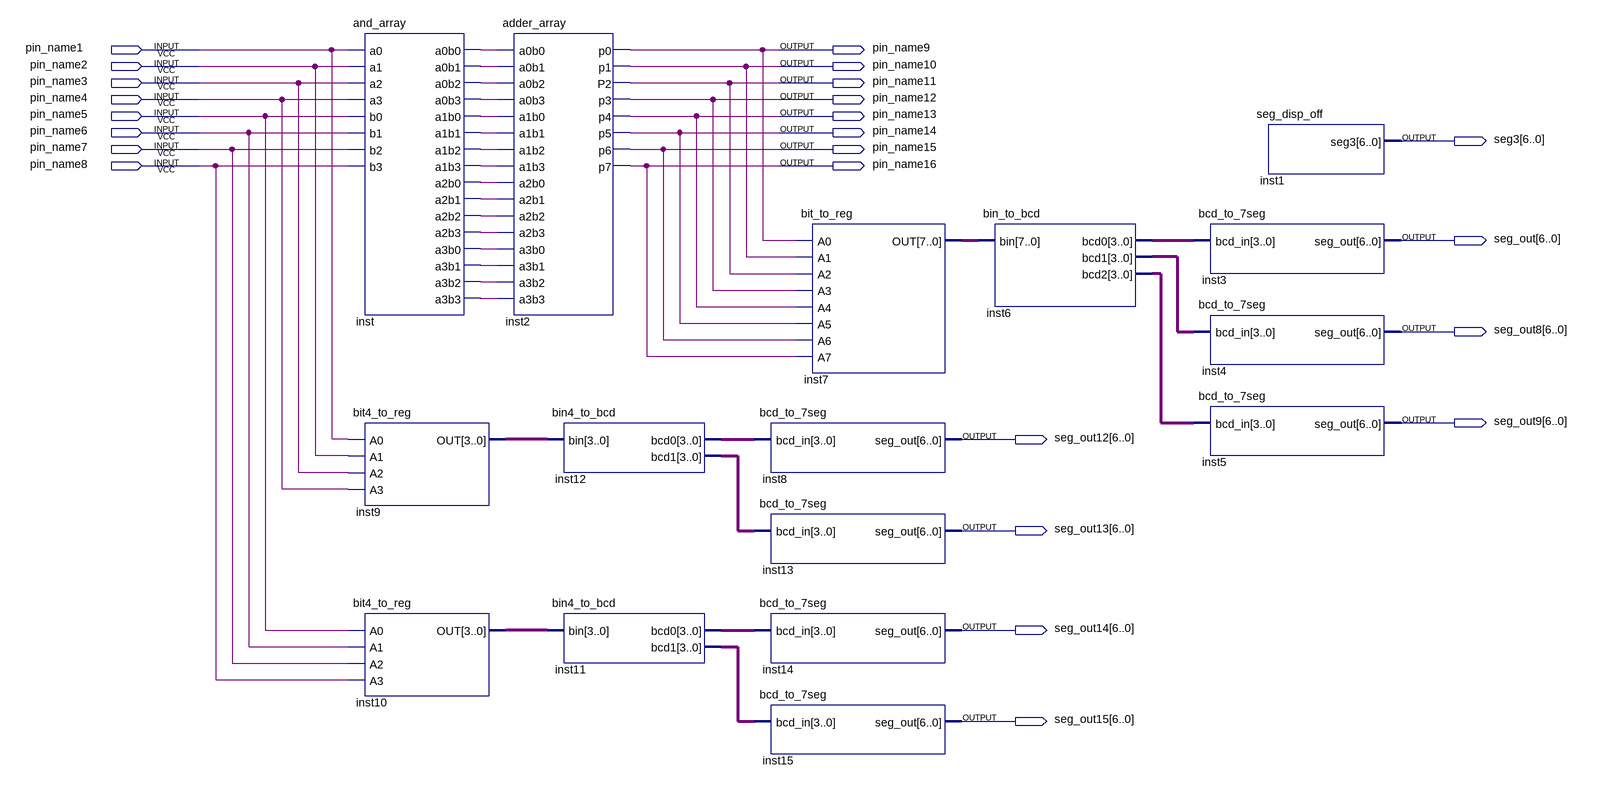
[diagram p0: schematic sheet]
// Quartus schematic multiplier_v.bdf as structural Verilog: 16 symbols, 24 pins
module multiplier_v (
  input  pin_name1,
  input  pin_name2,
  input  pin_name3,
  input  pin_name4,
  input  pin_name5,
  input  pin_name6,
  input  pin_name7,
  input  pin_name8,
  output pin_name9,
  output pin_name10,
  output pin_name11,
  output pin_name12,
  output pin_name13,
  output pin_name14,
  output [6:0] seg3,
  output pin_name15,
  output pin_name16,
  output [6:0] seg_out,
  output [6:0] seg_out8,
  output [6:0] seg_out9,
  output [6:0] seg_out12,
  output [6:0] seg_out13,
  output [6:0] seg_out14,
  output [6:0] seg_out15
);

  wire inst_a0b0, inst_a0b1, inst_a0b2, inst_a0b3, inst_a1b0, inst_a1b1, inst_a1b2, inst_a1b3, inst_a2b0,
       inst_a2b1, inst_a2b2, inst_a2b3, inst_a3b0, inst_a3b1, inst_a3b2, inst_a3b3;
  wire [3:0] inst6_bcd0, inst6_bcd1, inst6_bcd2, inst9_out, inst10_out, inst11_bcd0, inst11_bcd1,
       inst12_bcd0, inst12_bcd1;
  wire [7:0] inst7_out;

  and_array inst (
    .a0(pin_name1), .a1(pin_name2), .a2(pin_name3), .a3(pin_name4), .b0(pin_name5), .b1(pin_name6),
    .b2(pin_name7), .b3(pin_name8), .a0b0(inst_a0b0), .a0b1(inst_a0b1), .a0b2(inst_a0b2), .a0b3(inst_a0b3),
    .a1b0(inst_a1b0), .a1b1(inst_a1b1), .a1b2(inst_a1b2), .a1b3(inst_a1b3), .a2b0(inst_a2b0),
    .a2b1(inst_a2b1), .a2b2(inst_a2b2), .a2b3(inst_a2b3), .a3b0(inst_a3b0), .a3b1(inst_a3b1),
    .a3b2(inst_a3b2), .a3b3(inst_a3b3));
  bit4_to_reg inst9 (.A0(pin_name1), .A1(pin_name2), .A2(pin_name3), .A3(pin_name4), .OUT(inst9_out));
  bit4_to_reg inst10 (.A0(pin_name5), .A1(pin_name6), .A2(pin_name7), .A3(pin_name8), .OUT(inst10_out));
  adder_array inst2 (
    .a0b0(inst_a0b0), .a0b1(inst_a0b1), .a0b2(inst_a0b2), .a0b3(inst_a0b3), .a1b0(inst_a1b0),
    .a1b1(inst_a1b1), .a1b2(inst_a1b2), .a1b3(inst_a1b3), .a2b0(inst_a2b0), .a2b1(inst_a2b1),
    .a2b2(inst_a2b2), .a2b3(inst_a2b3), .a3b0(inst_a3b0), .a3b1(inst_a3b1), .a3b2(inst_a3b2),
    .a3b3(inst_a3b3), .p0(pin_name9), .p1(pin_name10), .P2(pin_name11), .p3(pin_name12), .p4(pin_name13),
    .p5(pin_name14), .p6(pin_name15), .p7(pin_name16));
  bin4_to_bcd inst12 (.bin(inst9_out), .bcd0(inst12_bcd0), .bcd1(inst12_bcd1));
  bin4_to_bcd inst11 (.bin(inst10_out), .bcd0(inst11_bcd0), .bcd1(inst11_bcd1));
  bcd_to_7seg inst8 (.bcd_in(inst12_bcd0), .seg_out(seg_out12));
  bcd_to_7seg inst13 (.bcd_in(inst12_bcd1), .seg_out(seg_out13));
  bcd_to_7seg inst14 (.bcd_in(inst11_bcd0), .seg_out(seg_out14));
  bcd_to_7seg inst15 (.bcd_in(inst11_bcd1), .seg_out(seg_out15));
  bit_to_reg inst7 (
    .A0(pin_name9), .A1(pin_name10), .A2(pin_name11), .A3(pin_name12), .A4(pin_name13), .A5(pin_name14),
    .A6(pin_name15), .A7(pin_name16), .OUT(inst7_out));
  bin_to_bcd inst6 (.bin(inst7_out), .bcd0(inst6_bcd0), .bcd1(inst6_bcd1), .bcd2(inst6_bcd2));
  bcd_to_7seg inst3 (.bcd_in(inst6_bcd0), .seg_out(seg_out));
  bcd_to_7seg inst4 (.bcd_in(inst6_bcd1), .seg_out(seg_out8));
  bcd_to_7seg inst5 (.bcd_in(inst6_bcd2), .seg_out(seg_out9));
  seg_disp_off inst1 (.seg3(seg3));
endmodule
